# EAGLE schematic RADAR (EAGLE 7.4.0), part 1 of 2

## Sheet 1 of 3: Power Management
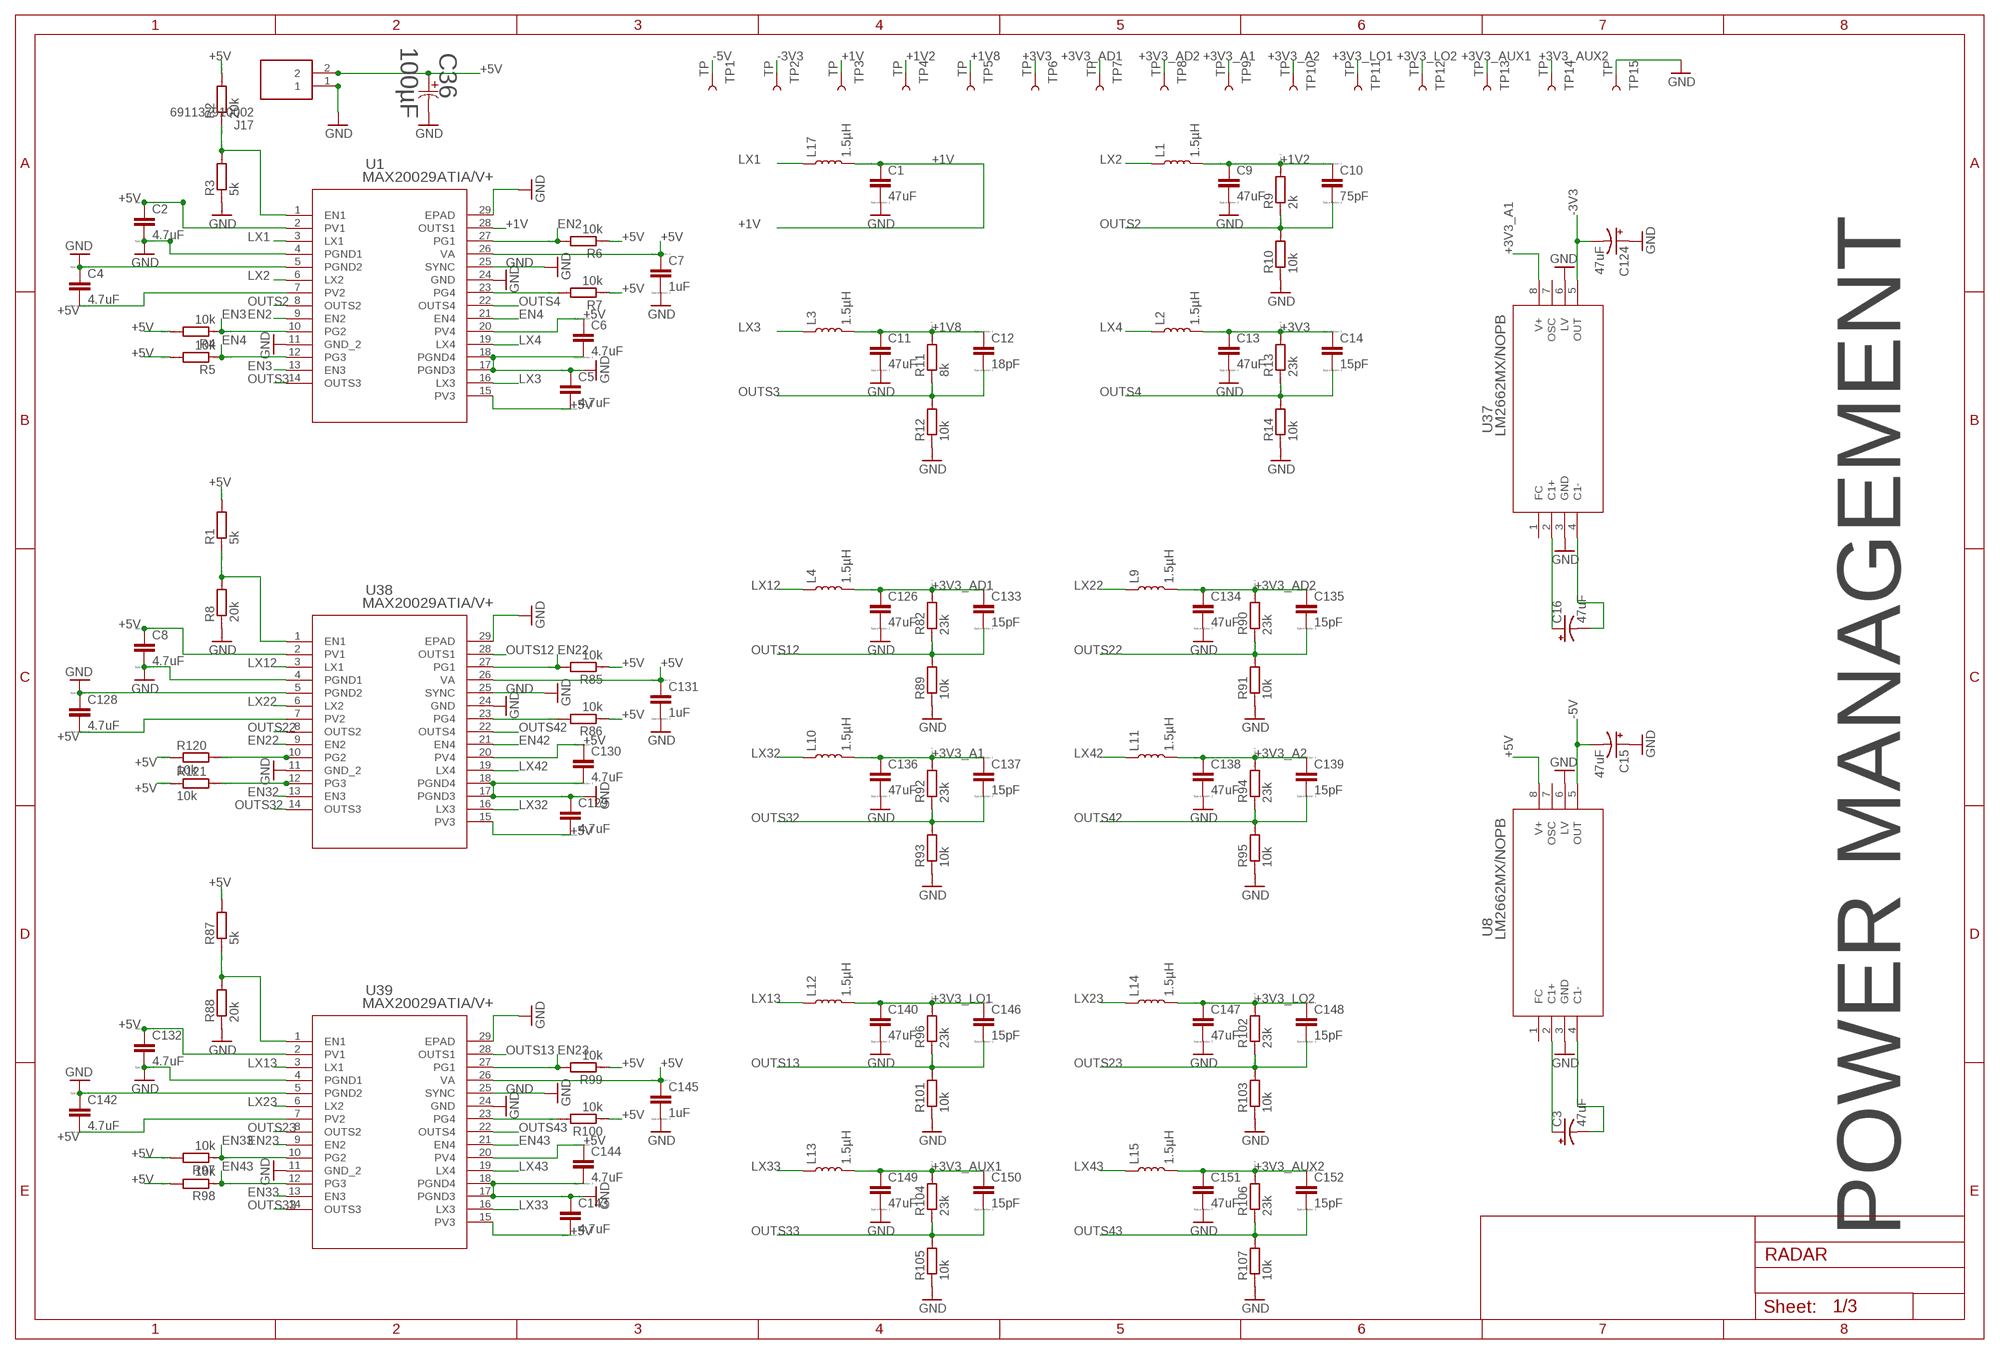
[diagram p0: schematic, sheet 1]

### Parts
C1  47uF  CC0201  [C0201]
C2  4.7uF  CC0201  [C0201]
C3  47uF  10UF-POLAR-0603-6.3V-20%(TANT)  [0603-POLAR]
C4  4.7uF  CC0201  [C0201]
C5  4.7uF  CC0201  [C0201]
C6  4.7uF  CC0201  [C0201]
C7  1uF  CC0201  [C0201]
C8  4.7uF  CC0201  [C0201]
C9  47uF  CC0201  [C0201]
C10  75pF  CC0201  [C0201]
C11  47uF  CC0201  [C0201]
C12  18pF  CC0201  [C0201]
C13  47uF  CC0201  [C0201]
C14  15pF  CC0201  [C0201]
C15  47uF  10UF-POLAR-0603-6.3V-20%(TANT)  [0603-POLAR]
C16  47uF  10UF-POLAR-0603-6.3V-20%(TANT)  [0603-POLAR]
C36  100µF  UCD1H101MNL1GS  [PCAP_8X10-ELECT_NCA]
C124  47uF  10UF-POLAR-0603-6.3V-20%(TANT)  [0603-POLAR]
C126  47uF  CC0201  [C0201]
C128  4.7uF  CC0201  [C0201]
C129  4.7uF  CC0201  [C0201]
C130  4.7uF  CC0201  [C0201]
C131  1uF  CC0201  [C0201]
C132  4.7uF  CC0201  [C0201]
C133  15pF  CC0201  [C0201]
C134  47uF  CC0201  [C0201]
C135  15pF  CC0201  [C0201]
C136  47uF  CC0201  [C0201]
C137  15pF  CC0201  [C0201]
C138  47uF  CC0201  [C0201]
C139  15pF  CC0201  [C0201]
C140  47uF  CC0201  [C0201]
C142  4.7uF  CC0201  [C0201]
C143  4.7uF  CC0201  [C0201]
C144  4.7uF  CC0201  [C0201]
C145  1uF  CC0201  [C0201]
C146  15pF  CC0201  [C0201]
C147  47uF  CC0201  [C0201]
C148  15pF  CC0201  [C0201]
C149  47uF  CC0201  [C0201]
C150  15pF  CC0201  [C0201]
C151  47uF  CC0201  [C0201]
C152  15pF  CC0201  [C0201]
J17  691137910002  [691137910002]
L1  1.5µH  2.2μH_SHIELDED_INDUCTOR  [0806]
L2  1.5µH  2.2μH_SHIELDED_INDUCTOR  [0806]
L3  1.5µH  2.2μH_SHIELDED_INDUCTOR  [0806]
L4  1.5µH  2.2μH_SHIELDED_INDUCTOR  [0806]
L9  1.5µH  2.2μH_SHIELDED_INDUCTOR  [0806]
L10  1.5µH  2.2μH_SHIELDED_INDUCTOR  [0806]
L11  1.5µH  2.2μH_SHIELDED_INDUCTOR  [0806]
L12  1.5µH  2.2μH_SHIELDED_INDUCTOR  [0806]
L13  1.5µH  2.2μH_SHIELDED_INDUCTOR  [0806]
L14  1.5µH  2.2μH_SHIELDED_INDUCTOR  [0806]
L15  1.5µH  2.2μH_SHIELDED_INDUCTOR  [0806]
L17  1.5µH  2.2μH_SHIELDED_INDUCTOR  [0806]
R1  5k  RR0201  [R0201]
R2  20k  RR0201  [R0201]
R3  5k  RR0201  [R0201]
R4  10k  RR0201  [R0201]
R5  10k  RR0201  [R0201]
R6  10k  RR0201  [R0201]
R7  10k  RR0201  [R0201]
R8  20k  RR0201  [R0201]
R9  2k  RR0201  [R0201]
R10  10k  RR0201  [R0201]
R11  8k  RR0201  [R0201]
R12  10k  RR0201  [R0201]
R13  23k  RR0201  [R0201]
R14  10k  RR0201  [R0201]
R82  23k  RR0201  [R0201]
R85  10k  RR0201  [R0201]
R86  10k  RR0201  [R0201]
R87  5k  RR0201  [R0201]
R88  20k  RR0201  [R0201]
R89  10k  RR0201  [R0201]
R90  23k  RR0201  [R0201]
R91  10k  RR0201  [R0201]
R92  23k  RR0201  [R0201]
R93  10k  RR0201  [R0201]
R94  23k  RR0201  [R0201]
R95  10k  RR0201  [R0201]
R96  23k  RR0201  [R0201]
R97  10k  RR0201  [R0201]
R98  10k  RR0201  [R0201]
R99  10k  RR0201  [R0201]
R100  10k  RR0201  [R0201]
R101  10k  RR0201  [R0201]
R102  23k  RR0201  [R0201]
R103  10k  RR0201  [R0201]
R104  23k  RR0201  [R0201]
R105  10k  RR0201  [R0201]
R106  23k  RR0201  [R0201]
R107  10k  RR0201  [R0201]
R120  10k  RR0201  [R0201]
R121  10k  RR0201  [R0201]
TP1  TP  TEST-POINT2  [PAD.02X.02]
TP2  TP  TEST-POINT2  [PAD.02X.02]
TP3  TP  TEST-POINT2  [PAD.02X.02]
TP4  TP  TEST-POINT2  [PAD.02X.02]
TP5  TP  TEST-POINT2  [PAD.02X.02]
TP6  TP  TEST-POINT2  [PAD.02X.02]
TP7  TP  TEST-POINT2  [PAD.02X.02]
TP8  TP  TEST-POINT2  [PAD.02X.02]
TP9  TP  TEST-POINT2  [PAD.02X.02]
TP10  TP  TEST-POINT2  [PAD.02X.02]
TP11  TP  TEST-POINT2  [PAD.02X.02]
TP12  TP  TEST-POINT2  [PAD.02X.02]
TP13  TP  TEST-POINT2  [PAD.02X.02]
TP14  TP  TEST-POINT2  [PAD.02X.02]
TP15  TP  TEST-POINT2  [PAD.02X.02]
U1  MAX20029ATIA/V+  [21-0140L_T2855-5_MXM]
U8  LM2662MX/NOPB  [M08A]
U37  LM2662MX/NOPB  [M08A]
U38  MAX20029ATIA/V+  [21-0140L_T2855-5_MXM]
U39  MAX20029ATIA/V+  [21-0140L_T2855-5_MXM]

### Nets
+1V: C1.1 L17.2 TP3.1 U1.28(OUTS1) ; also sheet 2
+1V2: C9.1 C10.1 L1.2 R9.2 TP4.1
+1V8: C11.1 C12.1 L3.2 R11.2 TP5.1 ; also sheet 2
+3V3: C13.1 C14.1 L2.2 R13.2 TP6.1 ; also sheet 2
+3V3_A1: C136.1 C137.1 L10.2 R92.2 TP9.1 U37.8(V+) ; also sheet 3
+3V3_A2: C138.1 C139.1 L11.2 R94.2 TP10.1 ; also sheet 3
+3V3_AD1: C126.1 C133.1 L4.2 R82.2 TP7.1 ; also sheet 3
+3V3_AD2: C134.1 C135.1 L9.2 R90.2 TP8.1 ; also sheet 3
+3V3_AUX1: C149.1 C150.1 L13.2 R104.2 TP13.1
+3V3_AUX2: C151.1 C152.1 L15.2 R106.2 TP14.1
+3V3_LO1: C140.1 C146.1 L12.2 R96.2 TP11.1 ; also sheet 3
+3V3_LO2: C147.1 C148.1 L14.2 R102.2 TP12.1 ; also sheet 3
+5V: C2.1 C4.2 C5.2 C6.1 C7.1 C8.1 C36.1 C128.2 C129.2 C130.1 C131.1 C132.1 C142.2 C143.2 C144.1 C145.1 J17.2 R1.2 R2.2 R4.2 R5.2 R6.1 R7.1 R85.1 R86.1 R87.2 R97.2 R98.2 R99.1 R100.1 R120.1 R121.1 U1.2(PV1) U1.7(PV2) U1.15(PV3) U1.20(PV4) U1.26(VA) U8.8(V+) U38.2(PV1) U38.7(PV2) U38.15(PV3) U38.20(PV4) U38.26(VA) U39.2(PV1) U39.7(PV2) U39.15(PV3) U39.20(PV4) U39.26(VA) ; also sheet 2,3
-3V3: C124.- TP2.1 U37.5(OUT) ; also sheet 3
-5V: C15.- TP1.1 U8.5(OUT) ; also sheet 3
EN2: R6.2 U1.9(EN2) U1.27(PG1)
EN3: R4.1 U1.10(PG2) U1.13(EN3)
EN4: R5.1 U1.12(PG3) U1.21(EN4)
EN22: R85.2 U38.9(EN2) U38.27(PG1)
EN23: R99.2 U39.9(EN2) U39.27(PG1)
EN32: U38.13(EN3) ; also sheet 2
EN33: R97.1 U39.10(PG2) U39.13(EN3)
EN42: U38.21(EN4) ; also sheet 2
EN43: R98.1 U39.12(PG3) U39.21(EN4)
GND: C1.2 C2.2 C4.1 C5.1 C6.2 C7.2 C8.2 C9.2 C11.2 C13.2 C15.+ C36.2 C124.+ C126.2 C128.1 C129.1 C130.2 C131.2 C132.2 C134.2 C136.2 C138.2 C140.2 C142.1 C143.1 C144.2 C145.2 C147.2 C149.2 C151.2 J17.1 R3.1 R8.1 R10.1 R12.1 R14.1 R88.1 R89.1 R91.1 R93.1 R95.1 R101.1 R103.1 R105.1 R107.1 TP15.1 U1.4(PGND1) U1.5(PGND2) U1.11(GND_2) U1.17(PGND3) U1.18(PGND4) U1.24(GND) U1.25(SYNC) U1.29(EPAD) U8.3(GND) U8.6(LV) U37.3(GND) U37.6(LV) U38.4(PGND1) U38.5(PGND2) U38.11(GND_2) U38.17(PGND3) U38.18(PGND4) U38.24(GND) U38.25(SYNC) U38.29(EPAD) U39.4(PGND1) U39.5(PGND2) U39.11(GND_2) U39.17(PGND3) U39.18(PGND4) U39.24(GND) U39.25(SYNC) U39.29(EPAD) ; also sheet 2,3
LX1: L17.1 U1.3(LX1)
LX2: L1.1 U1.6(LX2)
LX3: L3.1 U1.16(LX3)
LX4: L2.1 U1.19(LX4)
LX12: L4.1 U38.3(LX1)
LX13: L12.1 U39.3(LX1)
LX22: L9.1 U38.6(LX2)
LX23: L14.1 U39.6(LX2)
LX32: L10.1 U38.16(LX3)
LX33: L13.1 U39.16(LX3)
LX42: L11.1 U38.19(LX4)
LX43: L15.1 U39.19(LX4)
N$1: R2.1 R3.2 U1.1(EN1)
N$2: C3.+ U8.2(C1+)
N$3: C3.- U8.4(C1-)
N$15: R7.2 U1.23(PG4)
N$82: C16.+ U37.2(C1+)
N$85: C16.- U37.4(C1-)
N$86: R1.1 R8.2 U38.1(EN1)
N$87: R86.2 U38.23(PG4)
N$88: R87.1 R88.2 U39.1(EN1)
N$89: R100.2 U39.23(PG4)
OUTS2: C10.2 R9.1 R10.2 U1.8(OUTS2)
OUTS3: C12.2 R11.1 R12.2 U1.14(OUTS3)
OUTS4: C14.2 R13.1 R14.2 U1.22(OUTS4)
OUTS12: C133.2 R82.1 R89.2 U38.28(OUTS1)
OUTS13: C146.2 R96.1 R101.2 U39.28(OUTS1)
OUTS22: C135.2 R90.1 R91.2 U38.8(OUTS2)
OUTS23: C148.2 R102.1 R103.2 U39.8(OUTS2)
OUTS32: C137.2 R92.1 R93.2 U38.14(OUTS3)
OUTS33: C150.2 R104.1 R105.2 U39.14(OUTS3)
OUTS42: C139.2 R94.1 R95.2 U38.22(OUTS4)
OUTS43: C152.2 R106.1 R107.2 U39.22(OUTS4)
PG22: R120.2 U38.10(PG2)
PG32: R121.2 U38.12(PG3)
Unconnected: U8.1(FC) U8.7(OSC) U37.1(FC) U37.7(OSC)

### Notes on the sheet
- POWER MANAGEMENT

## Sheet 2 of 3: Digital (FPGA+microcontroller)
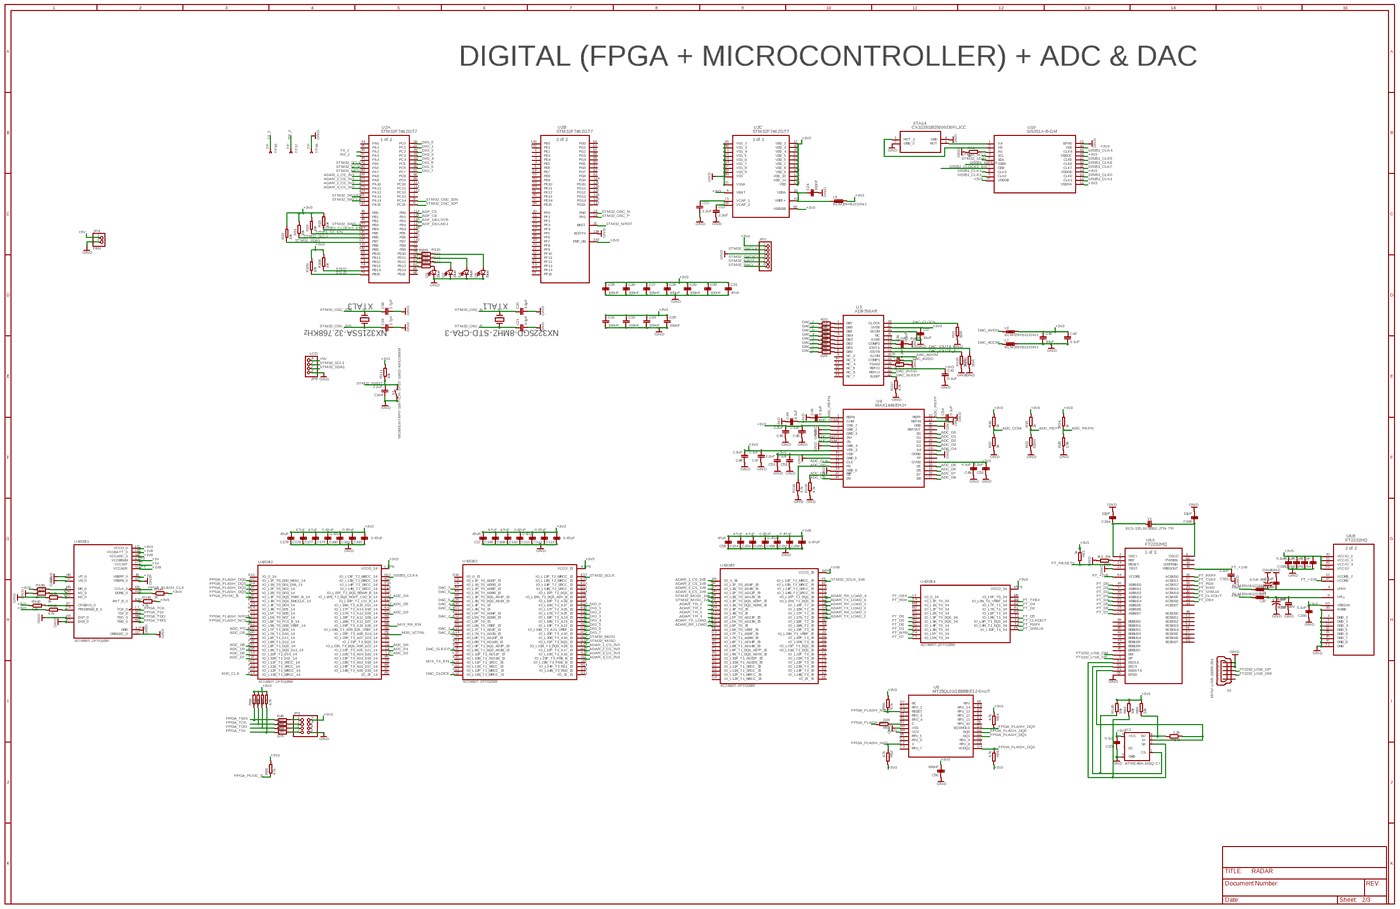
[diagram p1: schematic, sheet 2, overview]
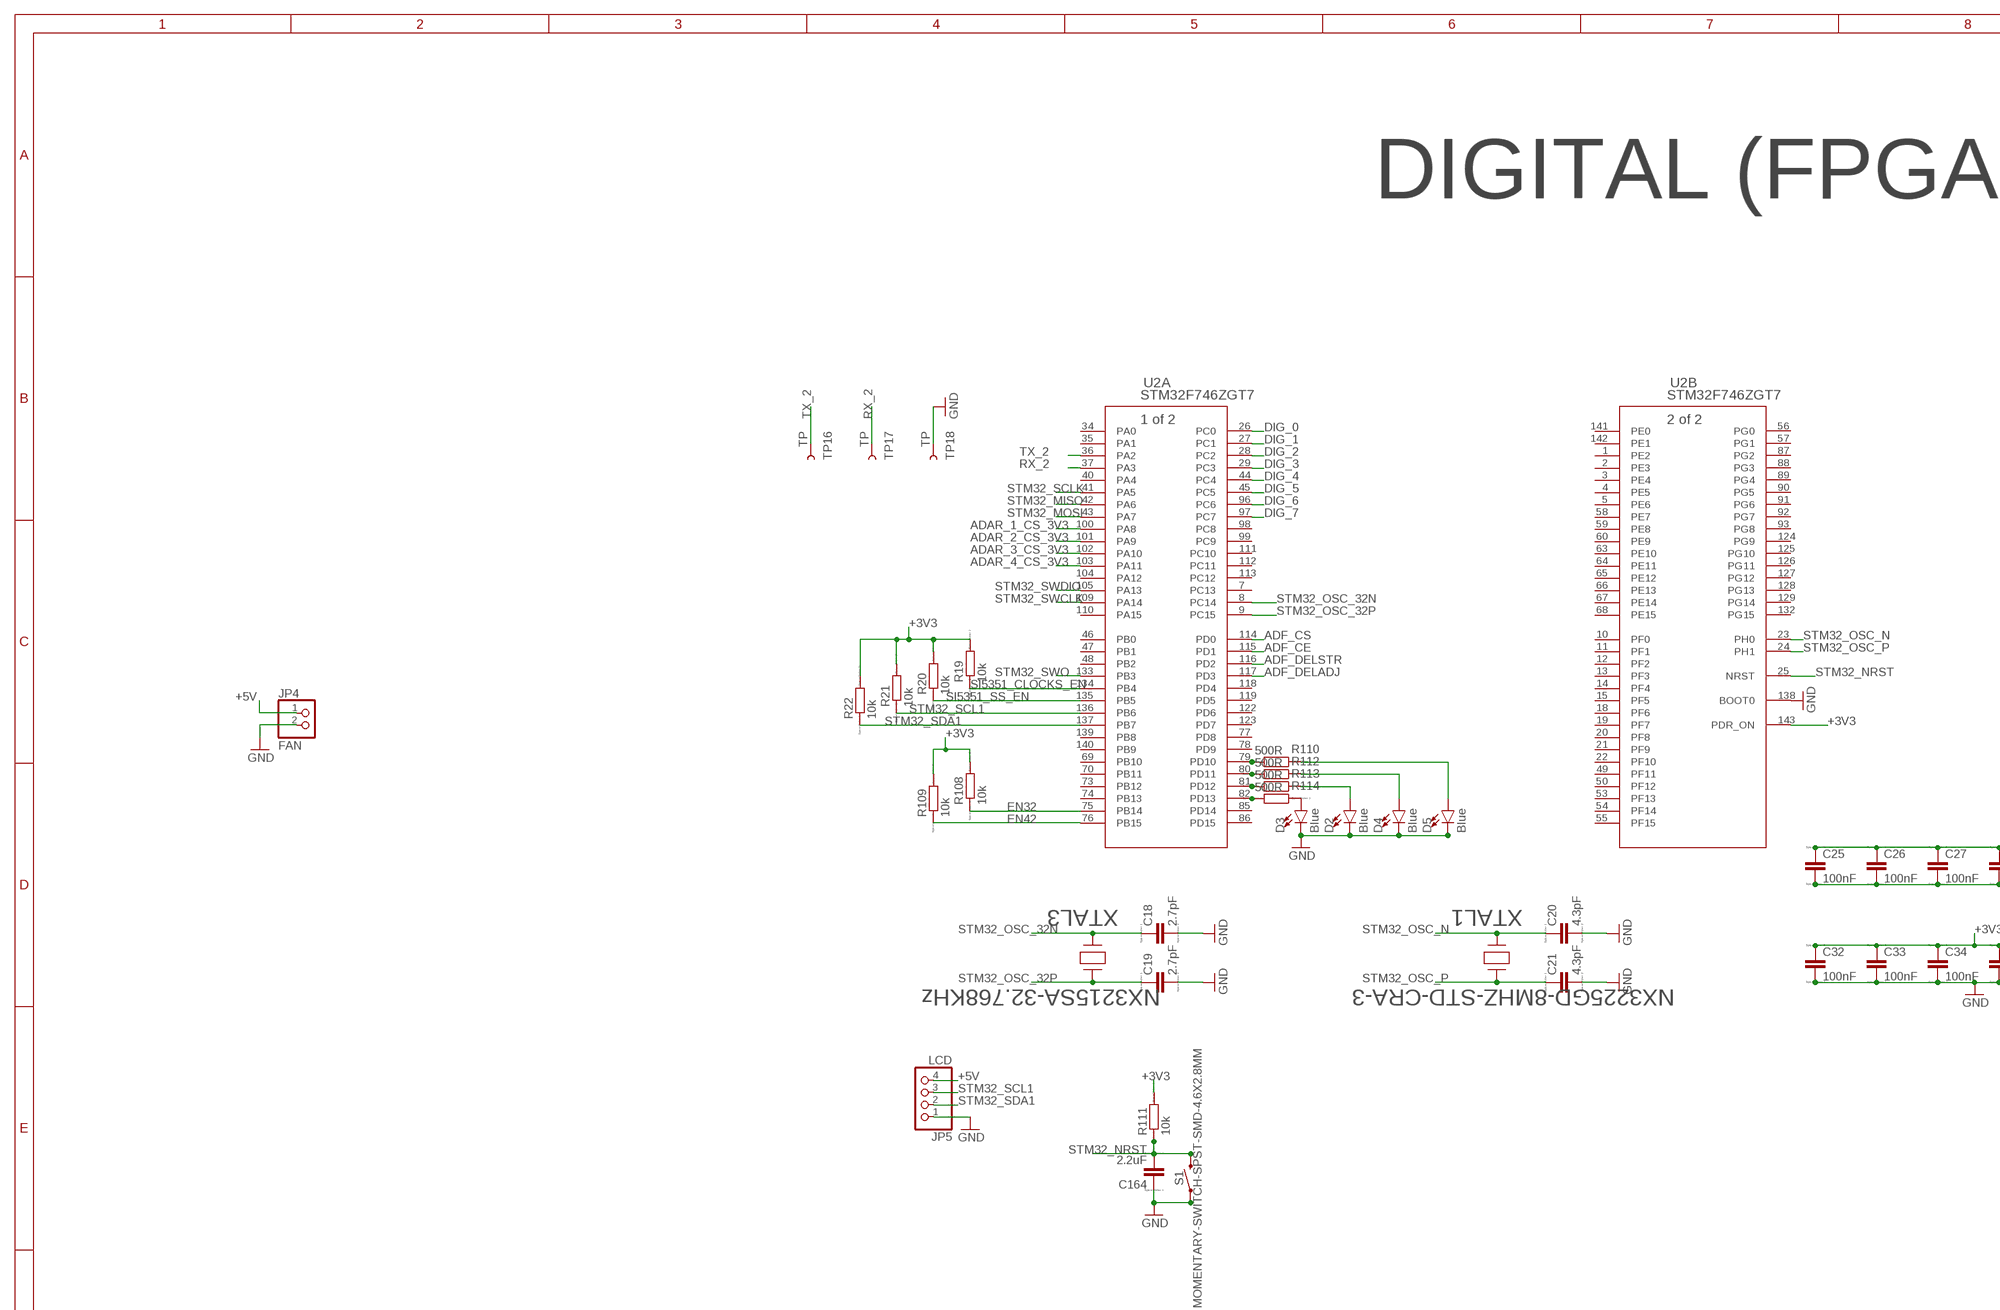
[diagram p2: schematic, sheet 2, part 1 of 4]
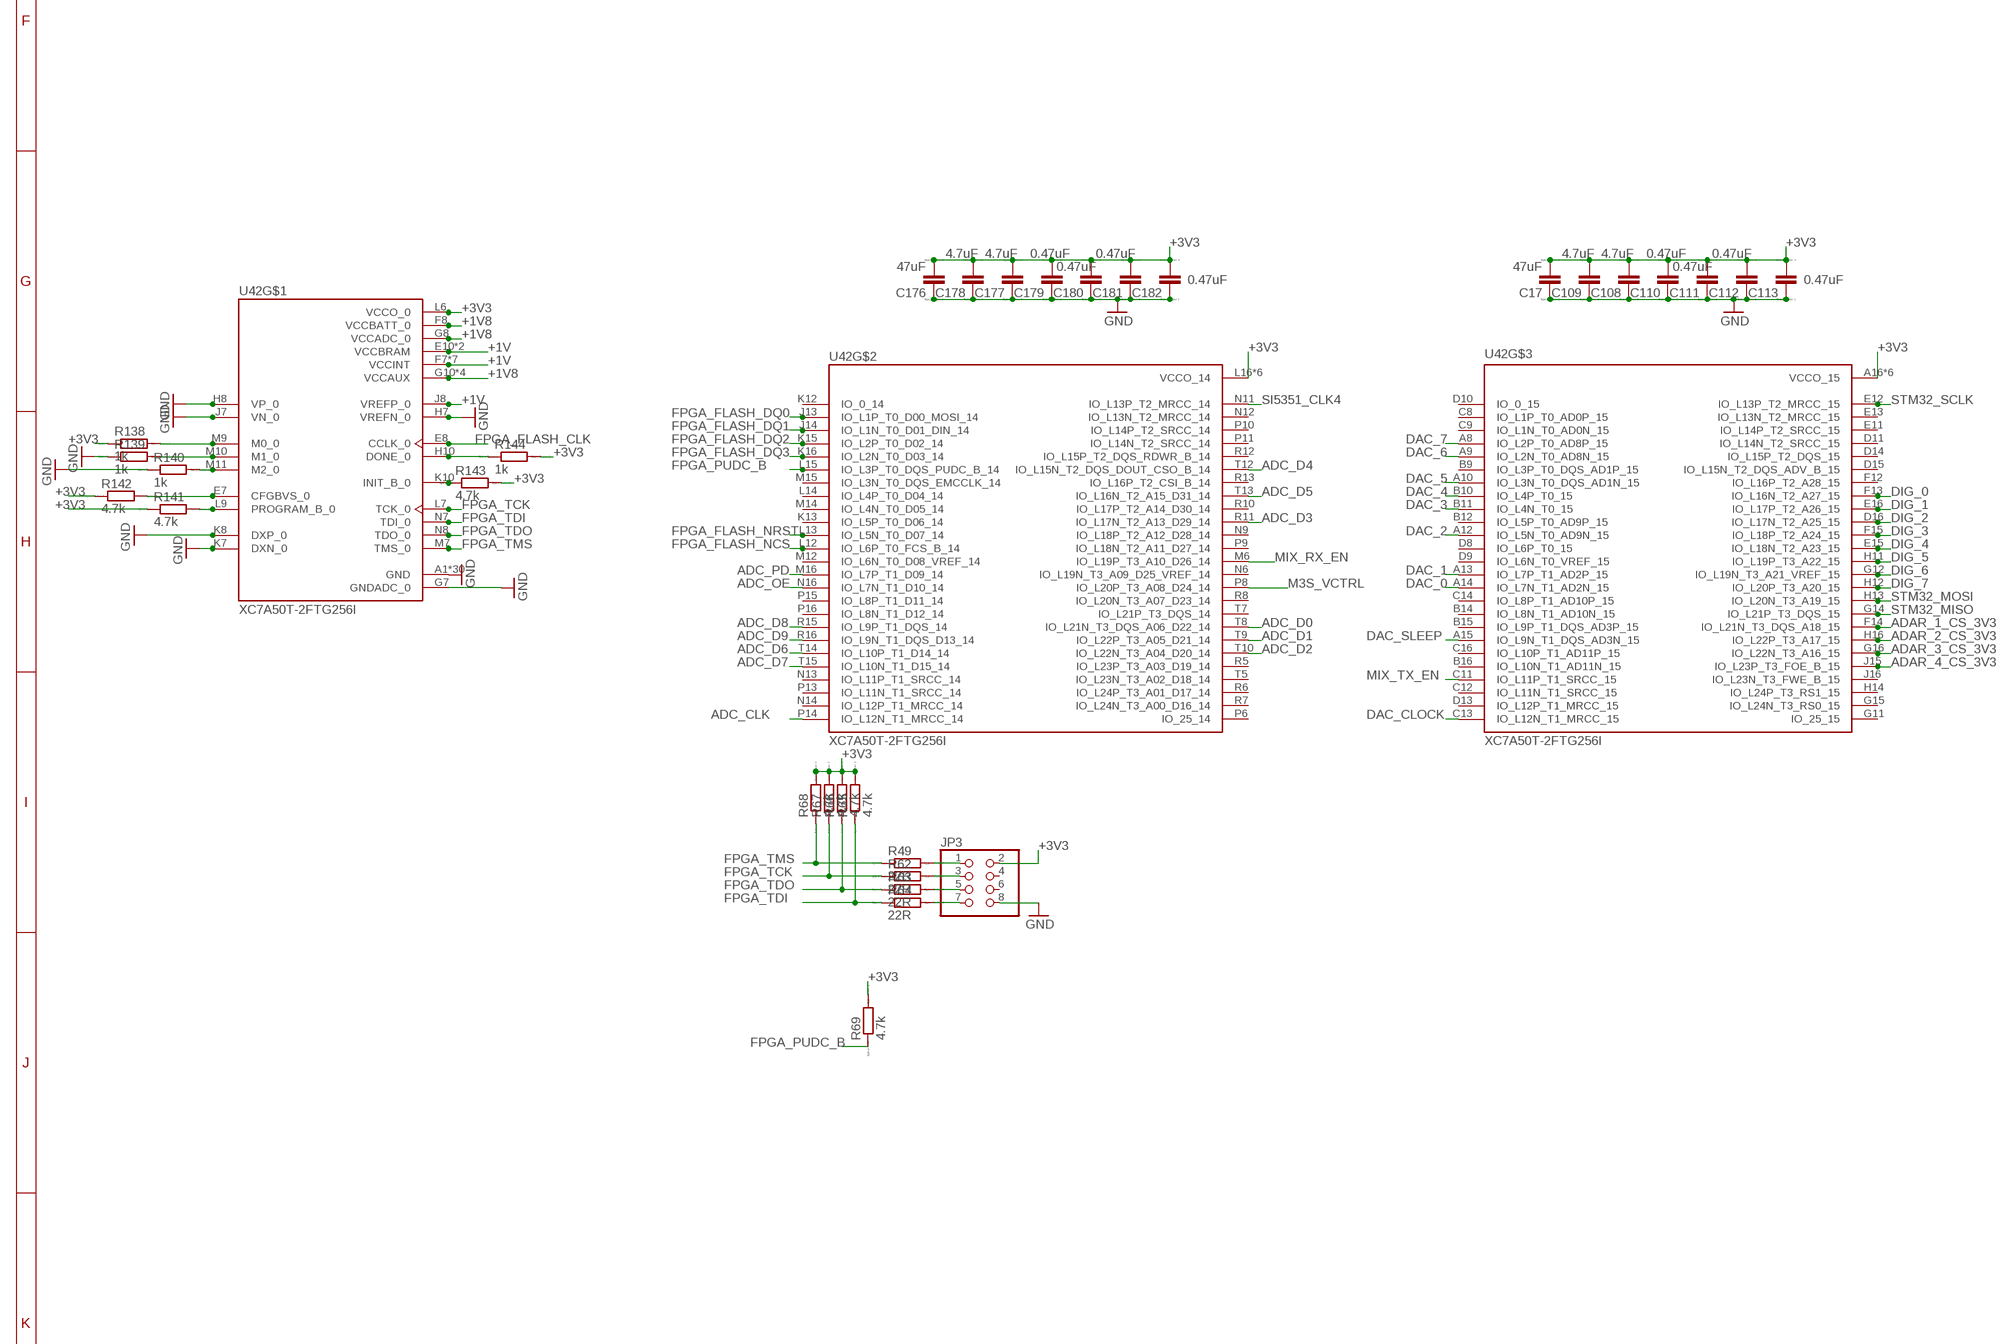
[diagram p3: schematic, sheet 2, part 2 of 4]
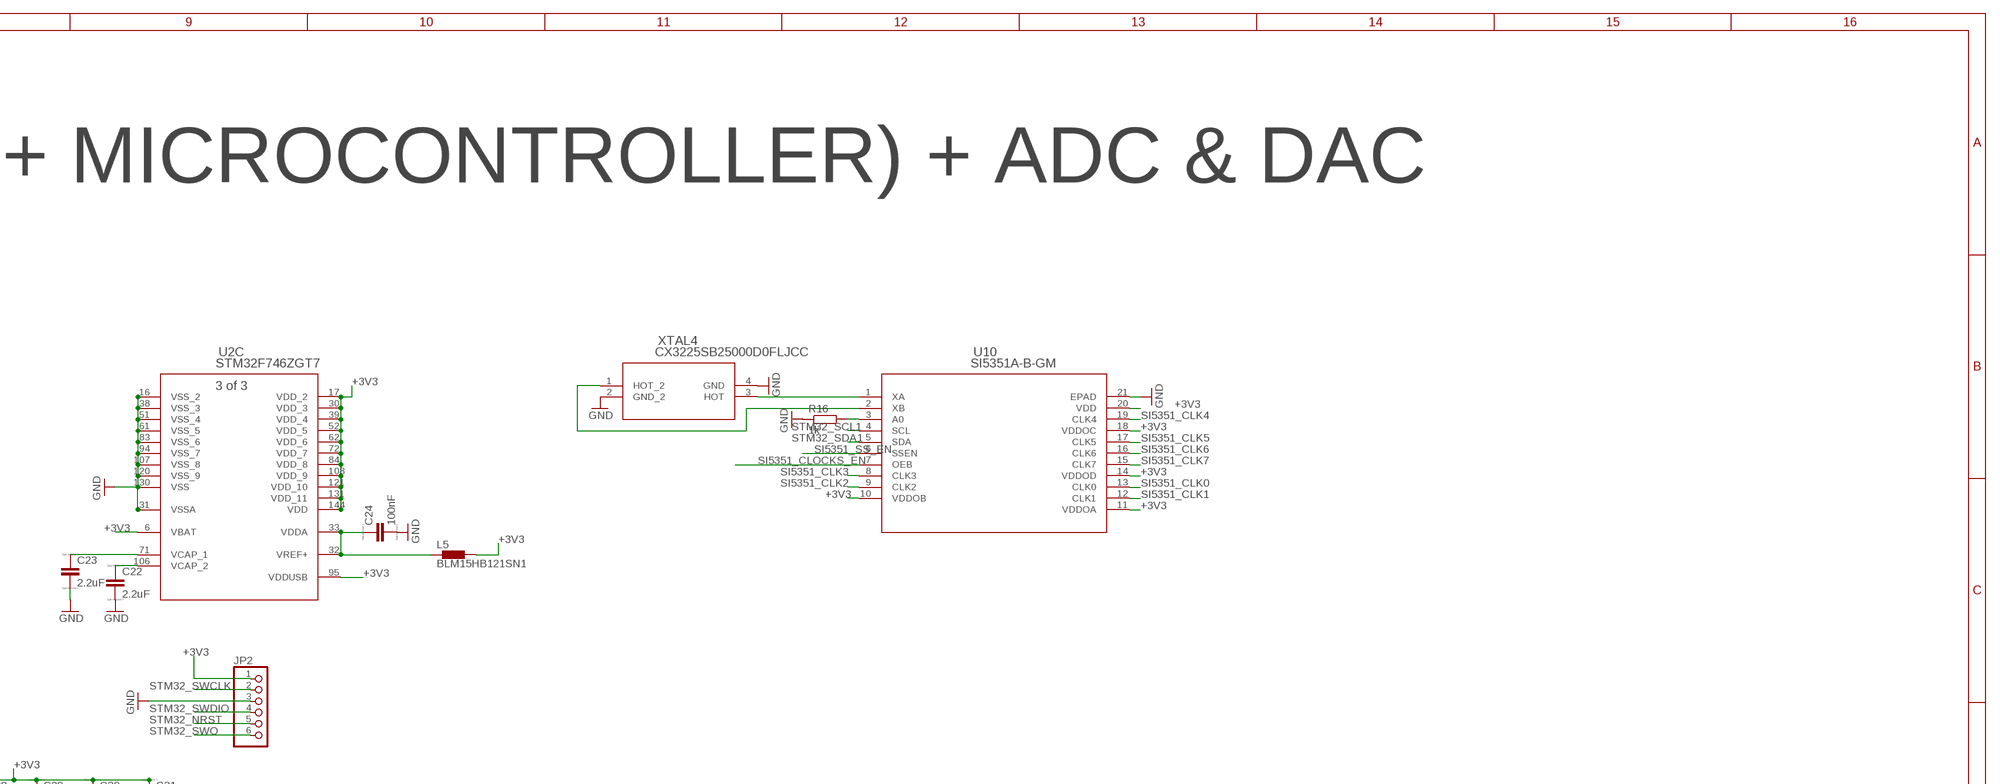
[diagram p4: schematic, sheet 2, part 3 of 4]
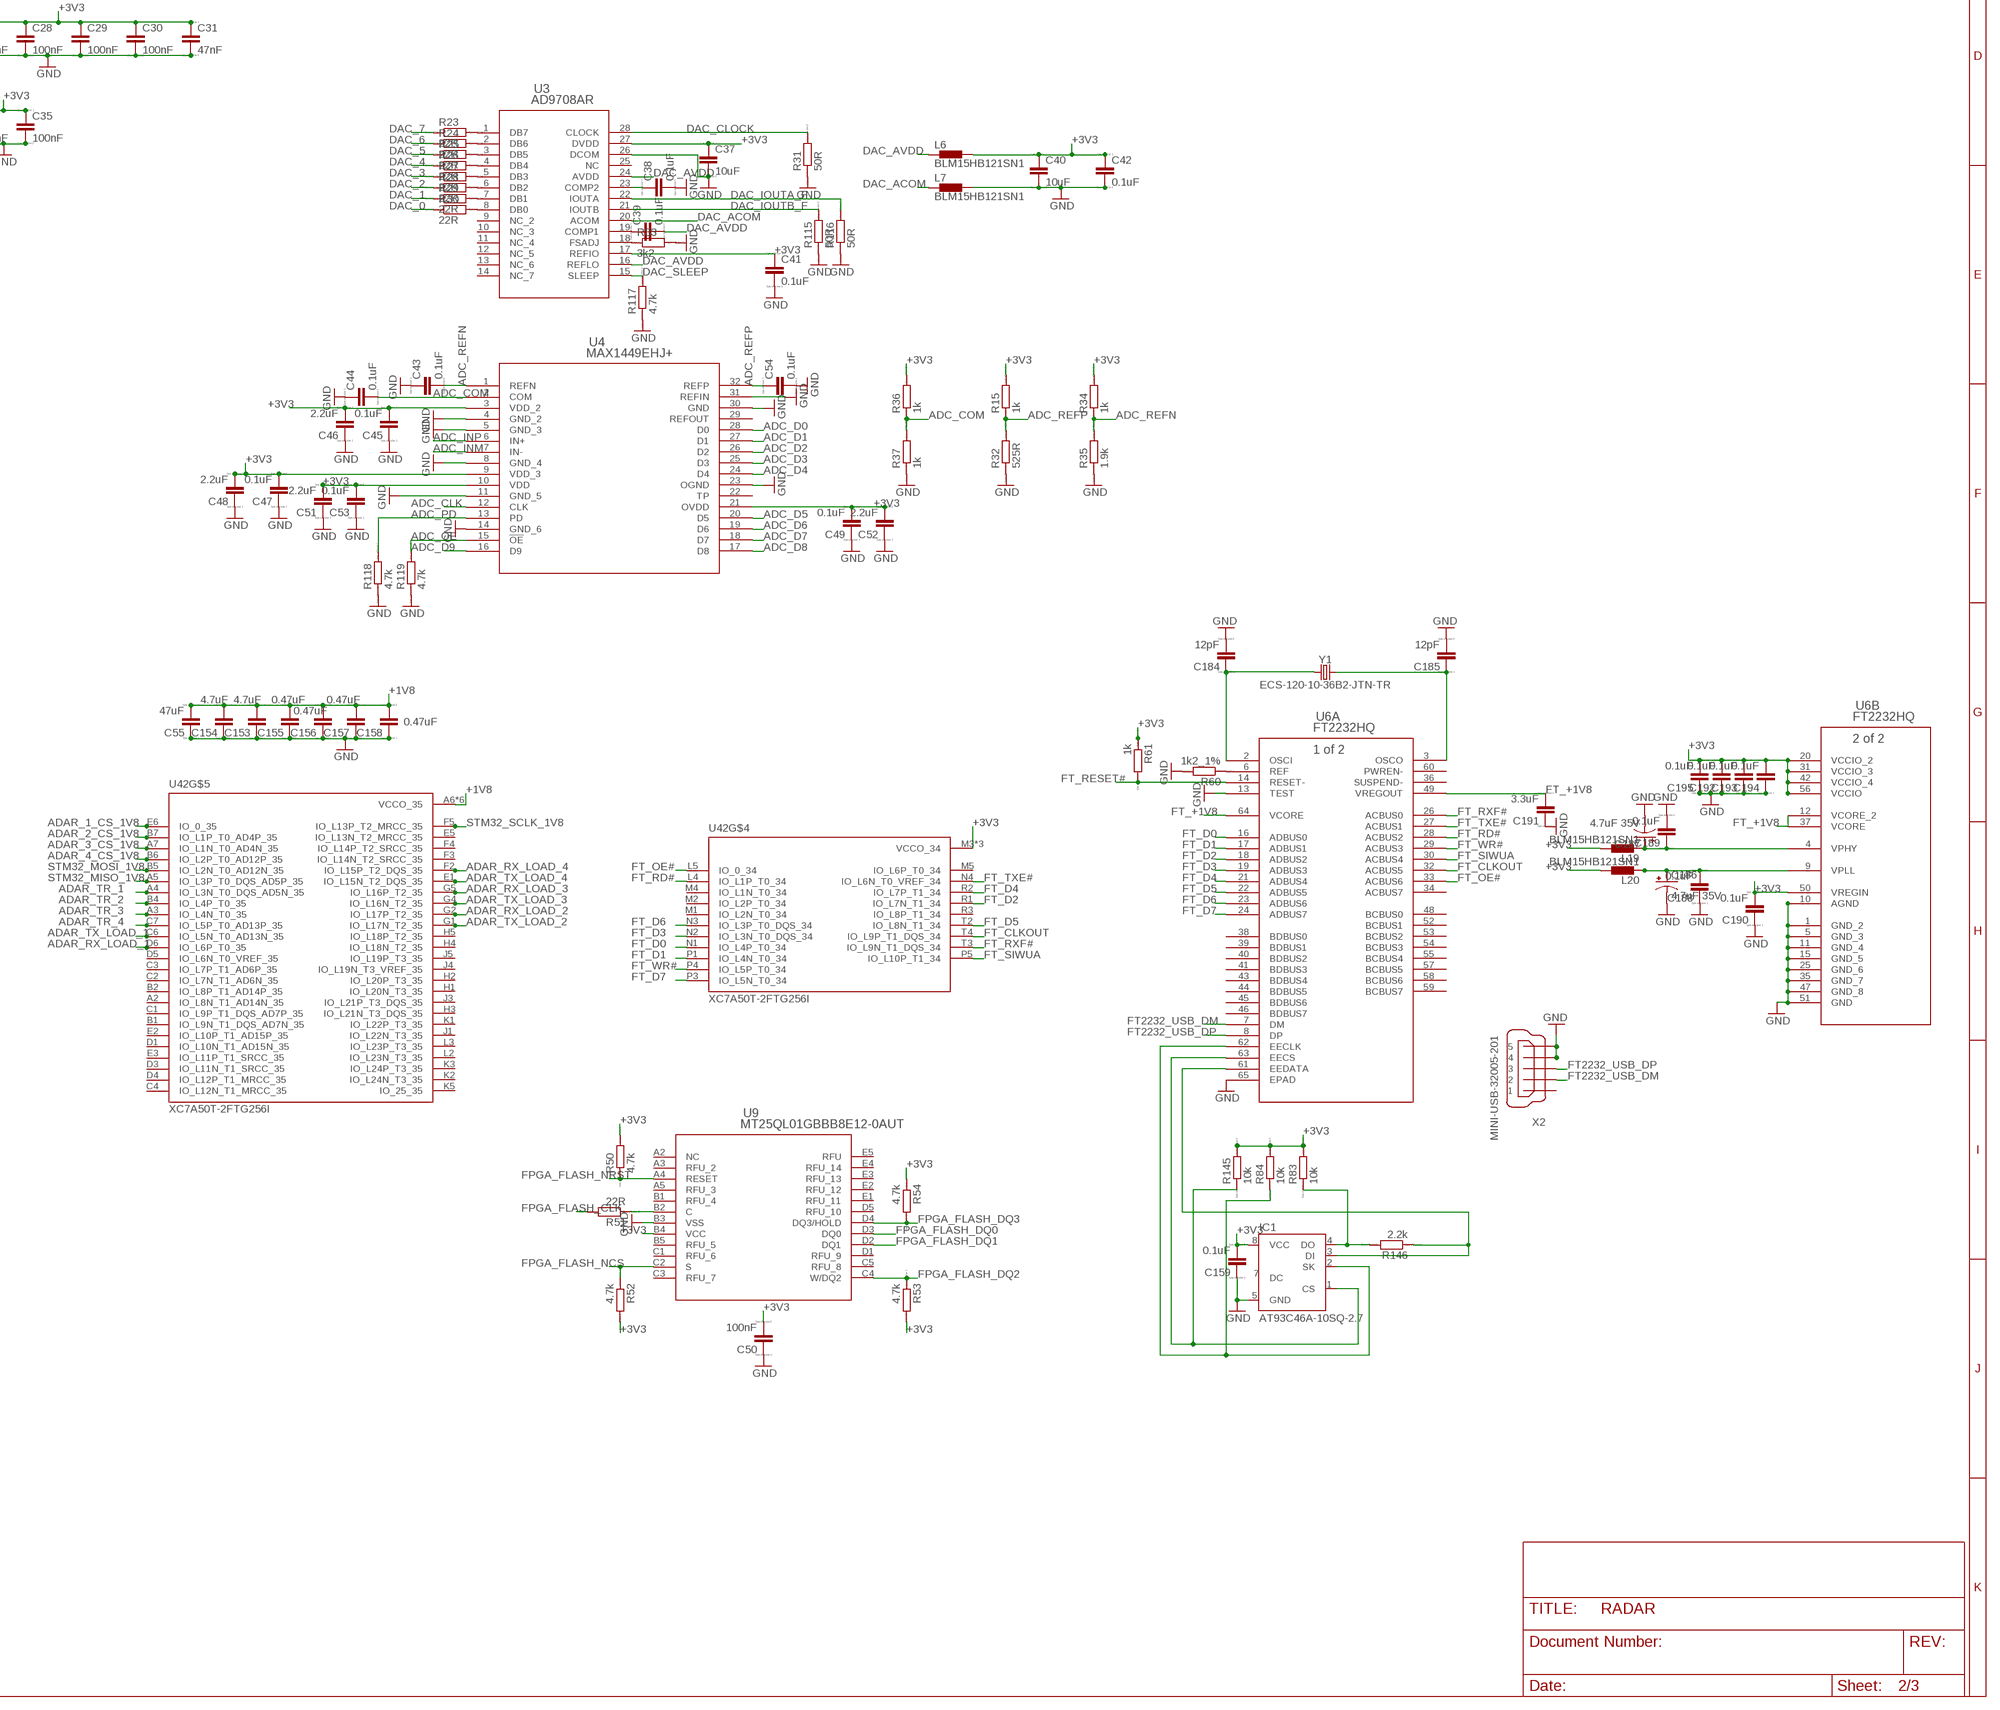
[diagram p5: schematic, sheet 2, part 4 of 4]

### Parts
C17  47uF  CC0201  [C0201]
C18  2.7pF  CC0201  [C0201]
C19  2.7pF  CC0201  [C0201]
C20  4.3pF  CC0201  [C0201]
C21  4.3pF  CC0201  [C0201]
C22  2.2uF  CC0201  [C0201]
C23  2.2uF  CC0201  [C0201]
C24  100nF  CC0201  [C0201]
C25  100nF  CC0201  [C0201]
C26  100nF  CC0201  [C0201]
C27  100nF  CC0201  [C0201]
C28  100nF  CC0201  [C0201]
C29  100nF  CC0201  [C0201]
C30  100nF  CC0201  [C0201]
C31  47nF  CC0201  [C0201]
C32  100nF  CC0201  [C0201]
C33  100nF  CC0201  [C0201]
C34  100nF  CC0201  [C0201]
C35  100nF  CC0201  [C0201]
C37  10uF  CC0201  [C0201]
C38  0.1uF  CC0201  [C0201]
C39  0.1uF  CC0201  [C0201]
C40  10uF  CC0201  [C0201]
C41  0.1uF  CC0201  [C0201]
C42  0.1uF  CC0201  [C0201]
C43  0.1uF  CC0201  [C0201]
C44  0.1uF  CC0201  [C0201]
C45  0.1uF  CC0201  [C0201]
C46  2.2uF  CC0201  [C0201]
C47  0.1uF  CC0201  [C0201]
C48  2.2uF  CC0201  [C0201]
C49  0.1uF  CC0201  [C0201]
C50  100nF  CC0201  [C0201]
C51  2.2uF  CC0201  [C0201]
C52  2.2uF  CC0201  [C0201]
C53  0.1uF  CC0201  [C0201]
C54  0.1uF  CC0201  [C0201]
C55  47uF  CC0201  [C0201]
C108  4.7uF  CC0201  [C0201]
C109  4.7uF  CC0201  [C0201]
C110  0.47uF  CC0201  [C0201]
C111  0.47uF  CC0201  [C0201]
C112  0.47uF  CC0201  [C0201]
C113  0.47uF  CC0201  [C0201]
C153  4.7uF  CC0201  [C0201]
C154  4.7uF  CC0201  [C0201]
C155  0.47uF  CC0201  [C0201]
C156  0.47uF  CC0201  [C0201]
C157  0.47uF  CC0201  [C0201]
C158  0.47uF  CC0201  [C0201]
C159  0.1uF  CC0201  [C0201]
C164  2.2uF  CC0201  [C0201]
C176  47uF  CC0201  [C0201]
C177  4.7uF  CC0201  [C0201]
C178  4.7uF  CC0201  [C0201]
C179  0.47uF  CC0201  [C0201]
C180  0.47uF  CC0201  [C0201]
C181  0.47uF  CC0201  [C0201]
C182  0.47uF  CC0201  [C0201]
C184  12pF  CC0201  [C0201]
C185  12pF  CC0201  [C0201]
C186  4.7uF 35V  4.7UF-POLAR-EIA3528-35V-10%(TANT)  [EIA3528]
C187  4.7uF 35V  4.7UF-POLAR-EIA3528-35V-10%(TANT)  [EIA3528]
C188  0.1uF  CC0201  [C0201]
C189  0.1uF  CC0201  [C0201]
C190  0.1uF  CC0201  [C0201]
C191  3.3uF  CC0201  [C0201]
C192  0.1uF  CC0201  [C0201]
C193  0.1uF  CC0201  [C0201]
C194  0.1uF  CC0201  [C0201]
C195  0.1uF  CC0201  [C0201]
D2  Blue  LED-BLUE0603  [LED-0603]
D3  Blue  LED-BLUE0603  [LED-0603]
D4  Blue  LED-BLUE0603  [LED-0603]
D5  Blue  LED-BLUE0603  [LED-0603]
IC1  AT93C46A-10SQ-2.7  [SOIC8]
JP2  PINHD-1X6  [1X06]
JP3  PINHD-2X4  [2X04]
JP4  FAN  PINHD-1X2  [1X02]
JP5  LCD  PINHD-1X4  [1X04]
L5  BLM15HB121SN1  [0402]
L6  BLM15HB121SN1  [0402]
L7  BLM15HB121SN1  [0402]
L19  BLM15HB121SN1  [0402]
L20  BLM15HB121SN1  [0402]
R15  1k  RR0201  [R0201]
R16  1k  RR0201  [R0201]
R19  10k  RR0201  [R0201]
R20  10k  RR0201  [R0201]
R21  10k  RR0201  [R0201]
R22  10k  RR0201  [R0201]
R23  22R  RR0201  [R0201]
R24  22R  RR0201  [R0201]
R25  22R  RR0201  [R0201]
R26  22R  RR0201  [R0201]
R27  22R  RR0201  [R0201]
R28  22R  RR0201  [R0201]
R29  22R  RR0201  [R0201]
R30  22R  RR0201  [R0201]
R31  50R  RR0201  [R0201]
R32  525R  RR0201  [R0201]
R33  3k2  RR0201  [R0201]
R34  1k  RR0201  [R0201]
R35  1.9k  RR0201  [R0201]
R36  1k  RR0201  [R0201]
R37  1k  RR0201  [R0201]
R49  22R  RR0201  [R0201]
R50  4.7k  RR0201  [R0201]
R51  22R  RR0201  [R0201]
R52  4.7k  RR0201  [R0201]
R53  4.7k  RR0201  [R0201]
R54  4.7k  RR0201  [R0201]
R60  1k2_1%  RR0201  [R0201]
R61  1k  RR0201  [R0201]
R62  22R  RR0201  [R0201]
R63  22R  RR0201  [R0201]
R64  22R  RR0201  [R0201]
R65  4.7k  RR0201  [R0201]
R66  4.7k  RR0201  [R0201]
R67  4.7k  RR0201  [R0201]
R68  4.7k  RR0201  [R0201]
R69  4.7k  RR0201  [R0201]
R83  10k  RR0201  [R0201]
R84  10k  RR0201  [R0201]
R108  10k  RR0201  [R0201]
R109  10k  RR0201  [R0201]
R110  500R  RR0201  [R0201]
R111  10k  RR0201  [R0201]
R112  500R  RR0201  [R0201]
R113  500R  RR0201  [R0201]
R114  500R  RR0201  [R0201]
R115  50R  RR0201  [R0201]
R116  50R  RR0201  [R0201]
R117  4.7k  RR0201  [R0201]
R118  4.7k  RR0201  [R0201]
R119  4.7k  RR0201  [R0201]
R138  1k  RR0201  [R0201]
R139  1k  RR0201  [R0201]
R140  1k  RR0201  [R0201]
R141  4.7k  RR0201  [R0201]
R142  4.7k  RR0201  [R0201]
R143  4.7k  RR0201  [R0201]
R144  1k  RR0201  [R0201]
R145  10k  RR0201  [R0201]
R146  2.2k  RR0201  [R0201]
S1  MOMENTARY-SWITCH-SPST-SMD-4.6X2.8MM  [TACTILE_SWITCH_SMD_4.6X2.8MM]
TP16  TP  TEST-POINT2  [PAD.02X.02]
TP17  TP  TEST-POINT2  [PAD.02X.02]
TP18  TP  TEST-POINT2  [PAD.02X.02]
U2  STM32F746ZGT7  [LQFP-144_STM]
U3  AD9708AR  [RW_28_ADI]
U4  MAX1449EHJ+  [21-0110B_MXM]
U6  FT2232HQ  [64QFN_FT2232HQ_FTD]
U9  MT25QL01GBBB8E12-0AUT  [BGA24_MT25QL_MRN]
U10  SI5351A-B-GM  [QFN20_SIL]
U42  XC7A50T-2FTG256I  [BGA256C100P16X16_1700X1700X155]
X2  MINI-USB-32005-201  [32005-201]
XTAL1  NX3225GD-8MHZ-STD-CRA-3  [XTAL_NX3225GD-8MHZ-STD-CRA-3_N]
XTAL3  NX3215SA-32.768KHz  NX3225GD-8MHZ-STD-CRA-3  [XTAL_NX3225GD-8MHZ-STD-CRA-3_N]
XTAL4  CX3225SB25000D0FLJCC  CX3225SB25000D0FLJZ1  [XTAL4_CX3225SB_AVX]
Y1  ECS-120-10-36B2-JTN-TR  CRYSTAL-12MHZ  [CRYSTAL-SMD-2X2.5MM]

### Nets
+1V: U42.E10(VCCBRAM) U42.F7(VCCINT) U42.F9(VCCINT) U42.F11(VCCBRAM) U42.G6(VCCINT) U42.H9(VCCINT) U42.J6(VCCINT) U42.J8(VREFP_0) U42.K9(VCCINT) U42.L8(VCCINT) ; also sheet 1
+1V8: C55.2 C153.2 C154.2 C155.2 C156.2 C157.2 C158.2 U42.A6(VCCO_35) U42.B3(VCCO_35) U42.D7(VCCO_35) U42.E4(VCCO_35) U42.F1(VCCO_35) U42.F8(VCCBATT_0) U42.G8(VCCADC_0) U42.G10(VCCAUX) U42.J2(VCCO_35) U42.J10(VCCAUX) U42.K11(VCCAUX) U42.L10(VCCAUX) ; also sheet 1
+3V3: C17.2 C25.1 C26.1 C27.1 C28.1 C29.1 C30.1 C31.1 C32.1 C33.1 C34.1 C35.1 C37.1 C40.1 C41.1 C42.1 C45.2 C46.2 C47.2 C48.2 C49.2 C50.2 C51.2 C52.2 C53.2 C108.2 C109.2 C110.2 C111.2 C112.2 C113.2 C159.2 C176.2 C177.2 C178.2 C179.2 C180.2 C181.2 C182.2 C190.2 C192.2 C193.2 C194.2 C195.2 IC1.8(VCC) JP2.1 JP3.2 L5.2 L6.2 L19.2 L20.2 R15.2 R19.2 R20.2 R21.2 R22.2 R34.2 R36.2 R50.2 R52.2 R53.2 R54.1 R61.1 R65.2 R66.2 R67.2 R68.2 R69.2 R83.2 R84.2 R108.2 R109.2 R111.2 R138.1 R141.1 R142.1 R143.2 R144.2 R145.2 U2.6(C:VBAT) U2.17(C:VDD_2) U2.30(C:VDD_3) U2.39(C:VDD_4) U2.52(C:VDD_5) U2.62(C:VDD_6) U2.72(C:VDD_7) U2.84(C:VDD_8) U2.95(C:VDDUSB) U2.108(C:VDD_9) U2.121(C:VDD_10) U2.131(C:VDD_11) U2.143(B:PDR_ON) U2.144(C:VDD) U3.17(REFIO) U3.27(DVDD) U4.3(VDD_2) U4.9(VDD_3) U4.10(VDD) U4.21(OVDD) U6.20(B:VCCIO_2) U6.31(B:VCCIO_3) U6.42(B:VCCIO_4) U6.50(B:VREGIN) U6.56(B:VCCIO) U9.B4(VCC) U10.10(VDDOB) U10.11(VDDOA) U10.14(VDDOD) U10.18(VDDOC) U10.20(VDD) U42.A16(VCCO_15) U42.B13(VCCO_15) U42.C10(VCCO_15) U42.E14(VCCO_15) U42.H15(VCCO_15) U42.J12(VCCO_15) U42.L6(VCCO_0) U42.L16(VCCO_14) U42.M3(VCCO_34) U42.M13(VCCO_14) U42.N10(VCCO_14) U42.P7(VCCO_14) U42.R4(VCCO_34) U42.R14(VCCO_14) U42.T1(VCCO_34) U42.T11(VCCO_14) ; also sheet 1
+5V: JP4.1 JP5.4 ; also sheet 1,3
ADAR_1_CS_1V8: U42.E6(IO_0_35) ; also sheet 3
ADAR_1_CS_3V3: U2.100(A:PA8) U42.F14(IO_L21N_T3_DQS_A18_15)
ADAR_2_CS_1V8: U42.B7(IO_L1P_T0_AD4P_35) ; also sheet 3
ADAR_2_CS_3V3: U2.101(A:PA9) U42.H16(IO_L22P_T3_A17_15)
ADAR_3_CS_1V8: U42.A7(IO_L1N_T0_AD4N_35) ; also sheet 3
ADAR_3_CS_3V3: U2.102(A:PA10) U42.G16(IO_L22N_T3_A16_15)
ADAR_4_CS_1V8: U42.B6(IO_L2P_T0_AD12P_35) ; also sheet 3
ADAR_4_CS_3V3: U2.103(A:PA11) U42.J15(IO_L23P_T3_FOE_B_15)
ADAR_RX_LOAD_1: U42.D6(IO_L6P_T0_35) ; also sheet 3
ADAR_RX_LOAD_2: U42.G2(IO_L17P_T2_35) ; also sheet 3
ADAR_RX_LOAD_3: U42.G5(IO_L16P_T2_35) ; also sheet 3
ADAR_RX_LOAD_4: U42.F2(IO_L15P_T2_DQS_35) ; also sheet 3
ADAR_TR_1: U42.A4(IO_L3N_T0_DQS_AD5N_35) ; also sheet 3
ADAR_TR_2: U42.B4(IO_L4P_T0_35) ; also sheet 3
ADAR_TR_3: U42.A3(IO_L4N_T0_35) ; also sheet 3
ADAR_TR_4: U42.C7(IO_L5P_T0_AD13P_35) ; also sheet 3
ADAR_TX_LOAD_1: U42.C6(IO_L5N_T0_AD13N_35) ; also sheet 3
ADAR_TX_LOAD_2: U42.G1(IO_L17N_T2_35) ; also sheet 3
ADAR_TX_LOAD_3: U42.G4(IO_L16N_T2_35) ; also sheet 3
ADAR_TX_LOAD_4: U42.E1(IO_L15N_T2_DQS_35) ; also sheet 3
ADC_CLK: U4.12(CLK) U42.P14(IO_L12N_T1_MRCC_14)
ADC_COM: C44.2 R36.1 R37.2 U4.2(COM) ; also sheet 3
ADC_D0: U4.28(D0) U42.T8(IO_L21N_T3_DQS_A06_D22_14)
ADC_D1: U4.27(D1) U42.T9(IO_L22P_T3_A05_D21_14)
ADC_D2: U4.26(D2) U42.T10(IO_L22N_T3_A04_D20_14)
ADC_D3: U4.25(D3) U42.R11(IO_L17N_T2_A13_D29_14)
ADC_D4: U4.24(D4) U42.T12(IO_L15N_T2_DQS_DOUT_CSO_B_14)
ADC_D5: U4.20(D5) U42.T13(IO_L16N_T2_A15_D31_14)
ADC_D6: U4.19(D6) U42.T14(IO_L10P_T1_D14_14)
ADC_D7: U4.18(D7) U42.T15(IO_L10N_T1_D15_14)
ADC_D8: U4.17(D8) U42.R15(IO_L9P_T1_DQS_14)
ADC_D9: U4.16(D9) U42.R16(IO_L9N_T1_DQS_D13_14)
ADC_INM: U4.7(IN-) ; also sheet 3
ADC_INP: U4.6(IN+) ; also sheet 3
ADC_OE: R119.2 U4.15(!OE) U42.N16(IO_L7N_T1_D10_14)
ADC_PD: R118.2 U4.13(PD) U42.M16(IO_L7P_T1_D09_14)
ADC_REFN: C43.2 R34.1 R35.2 U4.1(REFN)
ADC_REFP: C54.1 R15.1 R32.2 U4.32(REFP)
ADF_CE: U2.115(A:PD1) ; also sheet 3
ADF_CS: U2.114(A:PD0) ; also sheet 3
ADF_DELADJ: U2.117(A:PD3) ; also sheet 3
ADF_DELSTR: U2.116(A:PD2) ; also sheet 3
DAC_0: R30.1 U42.A14(IO_L7N_T1_AD2N_15)
DAC_1: R29.1 U42.A13(IO_L7P_T1_AD2P_15)
DAC_2: R28.1 U42.A12(IO_L5N_T0_AD9N_15)
DAC_3: R27.1 U42.B11(IO_L4N_T0_15)
DAC_4: R26.1 U42.B10(IO_L4P_T0_15)
DAC_5: R25.1 U42.A10(IO_L3N_T0_DQS_AD1N_15)
DAC_6: R24.1 U42.A9(IO_L2N_T0_AD8N_15)
DAC_7: R23.1 U42.A8(IO_L2P_T0_AD8P_15)
DAC_ACOM: L7.1 U3.20(ACOM)
DAC_AVDD: C39.2 L6.1 U3.16(REFLO) U3.24(AVDD)
DAC_CLOCK: R31.2 U3.28(CLOCK) U42.C13(IO_L12N_T1_MRCC_15)
DAC_IOUTA_F: R116.2 U3.22(IOUTA) ; also sheet 3
DAC_IOUTB_F: R115.2 U3.21(IOUTB) ; also sheet 3
DAC_SLEEP: R117.2 U3.15(SLEEP) U42.A15(IO_L9N_T1_DQS_AD3N_15)
DIG_0: U2.26(A:PC0) U42.F13(IO_L16N_T2_A27_15)
DIG_1: U2.27(A:PC1) U42.E16(IO_L17P_T2_A26_15)
DIG_2: U2.28(A:PC2) U42.D16(IO_L17N_T2_A25_15)
DIG_3: U2.29(A:PC3) U42.F15(IO_L18P_T2_A24_15)
DIG_4: U2.44(A:PC4) U42.E15(IO_L18N_T2_A23_15)
DIG_5: U2.45(A:PC5) U42.H11(IO_L19P_T3_A22_15)
DIG_6: U2.96(A:PC6) U42.G12(IO_L19N_T3_A21_VREF_15)
DIG_7: U2.97(A:PC7) U42.H12(IO_L20P_T3_A20_15)
EN32: R108.1 U2.75(A:PB14) ; also sheet 1
EN42: R109.1 U2.76(A:PB15) ; also sheet 1
FPGA_FLASH_CLK: R51.2 U42.E8(CCLK_0)
FPGA_FLASH_DQ0: U9.D3(DQ0) U42.J13(IO_L1P_T0_D00_MOSI_14)
FPGA_FLASH_DQ1: U9.D2(DQ1) U42.J14(IO_L1N_T0_D01_DIN_14)
FPGA_FLASH_DQ2: R53.1 U9.C4(W/DQ2) U42.K15(IO_L2P_T0_D02_14)
FPGA_FLASH_DQ3: R54.2 U9.D4(DQ3/HOLD) U42.K16(IO_L2N_T0_D03_14)
FPGA_FLASH_NCS: R52.1 U9.C2(S) U42.L12(IO_L6P_T0_FCS_B_14)
FPGA_FLASH_NRST: R50.1 U9.A4(RESET) U42.L13(IO_L5N_T0_D07_14)
FPGA_PUDC_B: R69.1 U42.L15(IO_L3P_T0_DQS_PUDC_B_14)
FPGA_TCK: R62.1 R67.1 U42.L7(TCK_0)
FPGA_TDI: R64.1 R65.1 U42.N7(TDI_0)
FPGA_TDO: R63.1 R66.1 U42.N8(TDO_0)
FPGA_TMS: R49.1 R68.1 U42.M7(TMS_0)
FT2232_USB_DM: U6.7(A:DM) X2.2
FT2232_USB_DP: U6.8(A:DP) X2.3
FT_+1V8: C191.2 U6.12(B:VCORE_2) U6.37(B:VCORE) U6.49(A:VREGOUT) U6.64(A:VCORE)
FT_CLKOUT: U6.32(A:ACBUS5) U42.T4(IO_L9P_T1_DQS_34)
FT_D0: U6.16(A:ADBUS0) U42.N1(IO_L4P_T0_34)
FT_D1: U6.17(A:ADBUS1) U42.P1(IO_L4N_T0_34)
FT_D2: U6.18(A:ADBUS2) U42.R1(IO_L7N_T1_34)
FT_D3: U6.19(A:ADBUS3) U42.N2(IO_L3N_T0_DQS_34)
FT_D4: U6.21(A:ADBUS4) U42.R2(IO_L7P_T1_34)
FT_D5: U6.22(A:ADBUS5) U42.T2(IO_L8N_T1_34)
FT_D6: U6.23(A:ADBUS6) U42.N3(IO_L3P_T0_DQS_34)
FT_D7: U6.24(A:ADBUS7) U42.P3(IO_L5N_T0_34)
FT_OE#: U6.33(A:ACBUS6) U42.L5(IO_0_34)
FT_RD#: U6.28(A:ACBUS2) U42.L4(IO_L1P_T0_34)
FT_RESET#: R61.2 U6.14(A:RESET-)
FT_RXF#: U6.26(A:ACBUS0) U42.T3(IO_L9N_T1_DQS_34)
FT_SIWUA: U6.30(A:ACBUS4) U42.P5(IO_L10P_T1_34)
FT_TXE#: U6.27(A:ACBUS1) U42.N4(IO_L6N_T0_VREF_34)
FT_WR#: U6.29(A:ACBUS3) U42.P4(IO_L5P_T0_34)
GND: C17.1 C18.2 C19.2 C20.2 C21.2 C22.2 C23.2 C24.2 C25.2 C26.2 C27.2 C28.2 C29.2 C30.2 C31.2 C32.2 C33.2 C34.2 C35.2 C37.2 C38.2 C40.2 C41.2 C42.2 C43.1 C44.1 C45.1 C46.1 C47.1 C48.1 C49.1 C50.1 C51.1 C52.1 C53.1 C54.2 C55.1 C108.1 C109.1 C110.1 C111.1 C112.1 C113.1 C153.1 C154.1 C155.1 C156.1 C157.1 C158.1 C159.1 C164.1 C176.1 C177.1 C178.1 C179.1 C180.1 C181.1 C182.1 C184.2 C185.2 C186.C(-) C187.C(-) C188.1 C189.2 C190.1 C191.1 C192.1 C193.1 C194.1 C195.1 D2.C D3.C D4.C D5.C IC1.5(GND) JP2.3 JP3.8 JP4.2 JP5.1 L7.2 R16.1 R31.1 R32.1 R33.2 R35.1 R37.1 R60.2 R115.1 R116.1 R117.1 R118.1 R119.1 R139.1 R140.1 S1.1 S1.2 TP18.1 U2.16(C:VSS_2) U2.31(C:VSSA) U2.38(C:VSS_3) U2.51(C:VSS_4) U2.61(C:VSS_5) U2.83(C:VSS_6) U2.94(C:VSS_7) U2.107(C:VSS_8) U2.120(C:VSS_9) U2.130(C:VSS) U2.138(B:BOOT0) U3.26(DCOM) U4.4(GND_2) U4.5(GND_3) U4.8(GND_4) U4.11(GND_5) U4.14(GND_6) U4.23(OGND) U4.30(GND) U4.31(REFIN) U6.1(B:GND_2) U6.5(B:GND_3) U6.10(B:AGND) U6.11(B:GND_4) U6.13(A:TEST) U6.15(B:GND_5) U6.25(B:GND_6) U6.35(B:GND_7) U6.47(B:GND_8) U6.51(B:GND) U6.65(A:EPAD) U9.B3(VSS) U10.21(EPAD) U42.A1(GND) U42.A11(GND) U42.B8(GND) U42.C5(GND) U42.C15(GND) U42.D2(GND) U42.D12(GND) U42.E9(GND) U42.F6(GND) U42.F10(GND) U42.F16(GND) U42.G3(GND) U42.G7(GNDADC_0) U42.G9(GND) U42.G13(GND) U42.H6(GND) U42.H7(VREFN_0) U42.H8(VP_0) U42.J7(VN_0) U42.J9(GND) U42.J11(GND) U42.K4(GND) U42.K6(GND) U42.K7(DXN_0) U42.K8(DXP_0) U42.K14(GND) U42.L1(GND) U42.L11(GND) U42.M8(GND) U42.N5(GND) U42.N15(GND) U42.P2(GND) U42.P12(GND) U42.R9(GND) U42.T6(GND) U42.T16(GND) X2.4 X2.5 XTAL4.2(GND_2) XTAL4.4(GND) ; also sheet 1,3
M3S_VCTRL: U42.P8(IO_L20P_T3_A08_D24_14) ; also sheet 3
MIX_RX_EN: U42.M6(IO_L19P_T3_A10_D26_14) ; also sheet 3
MIX_TX_EN: U42.C11(IO_L11P_T1_SRCC_15) ; also sheet 3
N$4: U10.1(XA) XTAL4.3(HOT)
N$5: U10.2(XB) XTAL4.1(HOT_2)
N$6: R16.2 U10.3(A0)
N$7: C23.1 U2.71(C:VCAP_1)
N$8: C22.1 U2.106(C:VCAP_2)
N$9: C24.1 L5.1 U2.32(C:VREF+) U2.33(C:VDDA)
N$10: R23.2 U3.1(DB7)
N$11: R24.2 U3.2(DB6)
N$12: R25.2 U3.3(DB5)
N$13: R26.2 U3.4(DB4)
N$14: R27.2 U3.5(DB3)
N$16: R28.2 U3.6(DB2)
N$18: R29.2 U3.7(DB1)
N$19: R30.2 U3.8(DB0)
N$22: R33.1 U3.18(FSADJ)
N$25: R51.1 U9.B2(C)
N$32: JP3.1 R49.2
N$33: JP3.3 R62.2
N$34: JP3.5 R63.2
N$36: JP3.7 R64.2
N$37: C38.1 U3.23(COMP2)
N$52: R110.2 U2.79(A:PD10)
N$90: IC1.4(DO) R83.1 R146.2
N$91: R112.2 U2.80(A:PD11)
N$92: D3.A R114.1
N$93: R113.2 U2.81(A:PD12)
N$94: R114.2 U2.82(A:PD13)
N$95: D2.A R113.1
N$96: C39.1 U3.19(COMP1)
N$97: D4.A R112.1
N$98: D5.A R110.1
N$106: R138.2 U42.M9(M0_0)
N$107: R139.2 U42.M10(M1_0)
N$108: R140.2 U42.M11(M2_0)
N$109: R141.2 U42.L9(PROGRAM_B_0)
N$114: R142.2 U42.E7(CFGBVS_0)
N$115: R144.1 U42.H10(DONE_0)
N$116: R143.1 U42.K10(INIT_B_0)
N$117: R60.1 U6.6(A:REF)
N$118: C184.1 U6.2(A:OSCI) Y1.P1
N$119: C185.1 U6.3(A:OSCO) Y1.P3
N$120: C186.A(+) C188.2 L20.1 U6.9(B:VPLL)
N$121: C187.A(+) C189.1 L19.1 U6.4(B:VPHY)
N$122: IC1.1(CS) R145.1 U6.63(A:EECS)
N$123: IC1.2(SK) R84.1 U6.62(A:EECLK)
N$124: IC1.3(DI) R146.1 U6.61(A:EEDATA)
RX_2: TP17.1 U2.37(A:PA3)
SI5351_CLK0: U10.13(CLK0)
SI5351_CLK1: U10.12(CLK1)
SI5351_CLK2: U10.9(CLK2)
SI5351_CLK3: U10.8(CLK3)
SI5351_CLK4: U10.19(CLK4) U42.N11(IO_L13P_T2_MRCC_14)
SI5351_CLK5: U10.17(CLK5)
SI5351_CLK6: U10.16(CLK6) ; also sheet 3
SI5351_CLK7: U10.15(CLK7)
SI5351_CLOCKS_EN: R19.1 U2.134(A:PB4) U10.7(OEB)
SI5351_SS_EN: R20.1 U2.135(A:PB5) U10.6(SSEN)
STM32_MISO: U2.42(A:PA6) U42.G14(IO_L21P_T3_DQS_15) ; also sheet 3
STM32_MISO_1V8: U42.A5(IO_L3P_T0_DQS_AD5P_35) ; also sheet 3
STM32_MOSI: U2.43(A:PA7) U42.H13(IO_L20N_T3_A19_15) ; also sheet 3
STM32_MOSI_1V8: U42.B5(IO_L2N_T0_AD12N_35) ; also sheet 3
STM32_NRST: C164.2 JP2.5 R111.1 S1.3 S1.4 U2.25(B:NRST)
STM32_OSC_32N: C18.1 U2.8(A:PC14) XTAL3.2
STM32_OSC_32P: C19.1 U2.9(A:PC15) XTAL3.1
STM32_OSC_N: C20.1 U2.23(B:PH0) XTAL1.2
STM32_OSC_P: C21.1 U2.24(B:PH1) XTAL1.1
STM32_SCL1: JP5.3 R21.1 U2.136(A:PB6) U10.4(SCL)
STM32_SCLK: U2.41(A:PA5) U42.E12(IO_L13P_T2_MRCC_15) ; also sheet 3
STM32_SCLK_1V8: U42.F5(IO_L13P_T2_MRCC_35) ; also sheet 3
STM32_SDA1: JP5.2 R22.1 U2.137(A:PB7) U10.5(SDA)
STM32_SWCLK: JP2.2 U2.109(A:PA14)
STM32_SWDIO: JP2.4 U2.105(A:PA13)
STM32_SWO: JP2.6 U2.133(A:PB3)
TX_2: TP16.1 U2.36(A:PA2)
Unconnected: IC1.6(NC) IC1.7(DC) JP3.4 JP3.6 U2.1(B:PE2) U2.2(B:PE3) U2.3(B:PE4) U2.4(B:PE5) U2.5(B:PE6) U2.7(A:PC13) U2.10(B:PF0) U2.11(B:PF1) U2.12(B:PF2) U2.13(B:PF3) U2.14(B:PF4) U2.15(B:PF5) U2.18(B:PF6) U2.19(B:PF7) U2.20(B:PF8) U2.21(B:PF9) U2.22(B:PF10) U2.34(A:PA0) U2.35(A:PA1) U2.40(A:PA4) U2.46(A:PB0) U2.47(A:PB1) U2.48(A:PB2) U2.49(B:PF11) U2.50(B:PF12) U2.53(B:PF13) U2.54(B:PF14) U2.55(B:PF15) U2.56(B:PG0) U2.57(B:PG1) U2.58(B:PE7) U2.59(B:PE8) U2.60(B:PE9) U2.63(B:PE10) U2.64(B:PE11) U2.65(B:PE12) U2.66(B:PE13) U2.67(B:PE14) U2.68(B:PE15) U2.69(A:PB10) U2.70(A:PB11) U2.73(A:PB12) U2.74(A:PB13) U2.77(A:PD8) U2.78(A:PD9) U2.85(A:PD14) U2.86(A:PD15) U2.87(B:PG2) U2.88(B:PG3) U2.89(B:PG4) U2.90(B:PG5) U2.91(B:PG6) U2.92(B:PG7) U2.93(B:PG8) U2.98(A:PC8) U2.99(A:PC9) U2.104(A:PA12) U2.110(A:PA15) U2.111(A:PC10) U2.112(A:PC11) U2.113(A:PC12) U2.118(A:PD4) U2.119(A:PD5) U2.122(A:PD6) U2.123(A:PD7) U2.124(B:PG9) U2.125(B:PG10) U2.126(B:PG11) U2.127(B:PG12) U2.128(B:PG13) U2.129(B:PG14) U2.132(B:PG15) U2.139(A:PB8) U2.140(A:PB9) U2.141(B:PE0) U2.142(B:PE1) U3.9(NC_2) U3.10(NC_3) U3.11(NC_4) U3.12(NC_5) U3.13(NC_6) U3.14(NC_7) U3.25(NC) U4.22(TP) U4.29(REFOUT) U6.34(A:ACBUS7) U6.36(A:SUSPEND-) U6.38(A:BDBUS0) U6.39(A:BDBUS1) U6.40(A:BDBUS2) U6.41(A:BDBUS3) U6.43(A:BDBUS4) U6.44(A:BDBUS5) U6.45(A:BDBUS6) U6.46(A:BDBUS7) U6.48(A:BCBUS0) U6.52(A:BCBUS1) U6.53(A:BCBUS2) U6.54(A:BCBUS3) U6.55(A:BCBUS4) U6.57(A:BCBUS5) U6.58(A:BCBUS6) U6.59(A:BCBUS7) U6.60(A:PWREN-) U9.A2(NC) U9.A3(RFU_2) U9.A5(RFU_3) U9.B1(RFU_4) U9.B5(RFU_5) U9.C1(RFU_6) U9.C3(RFU_7) U9.C5(RFU_8) U9.D1(RFU_9) U9.D5(RFU_10) U9.E1(RFU_11) U9.E2(RFU_12) U9.E3(RFU_13) U9.E4(RFU_14) U9.E5(RFU) U42.A2(IO_L8N_T1_AD14N_35) U42.B1(IO_L9N_T1_DQS_AD7N_35) U42.B2(IO_L8P_T1_AD14P_35) U42.B9(IO_L3P_T0_DQS_AD1P_15) U42.B12(IO_L5P_T0_AD9P_15) U42.B14(IO_L8N_T1_AD10N_15) U42.B15(IO_L9P_T1_DQS_AD3P_15) U42.B16(IO_L10N_T1_AD11N_15) U42.C1(IO_L9P_T1_DQS_AD7P_35) U42.C2(IO_L7N_T1_AD6N_35) U42.C3(IO_L7P_T1_AD6P_35) U42.C4(IO_L12N_T1_MRCC_35) U42.C8(IO_L1P_T0_AD0P_15) U42.C9(IO_L1N_T0_AD0N_15) U42.C12(IO_L11N_T1_SRCC_15) U42.C14(IO_L8P_T1_AD10P_15) U42.C16(IO_L10P_T1_AD11P_15) U42.D1(IO_L10N_T1_AD15N_35) U42.D3(IO_L11N_T1_SRCC_35) U42.D4(IO_L12P_T1_MRCC_35) U42.D5(IO_L6N_T0_VREF_35) U42.D8(IO_L6P_T0_15) U42.D9(IO_L6N_T0_VREF_15) U42.D10(IO_0_15) U42.D11(IO_L14N_T2_SRCC_15) U42.D13(IO_L12P_T1_MRCC_15) U42.D14(IO_L15P_T2_DQS_15) U42.D15(IO_L15N_T2_DQS_ADV_B_15) U42.E2(IO_L10P_T1_AD15P_35) U42.E3(IO_L11P_T1_SRCC_35) U42.E5(IO_L13N_T2_MRCC_35) U42.E11(IO_L14P_T2_SRCC_15) U42.E13(IO_L13N_T2_MRCC_15) U42.F3(IO_L14N_T2_SRCC_35) U42.F4(IO_L14P_T2_SRCC_35) U42.F12(IO_L16P_T2_A28_15) U42.G11(IO_25_15) U42.G15(IO_L24N_T3_RS0_15) U42.H1(IO_L20N_T3_35) U42.H2(IO_L20P_T3_35) U42.H3(IO_L21N_T3_DQS_35) U42.H4(IO_L18N_T2_35) U42.H5(IO_L18P_T2_35) U42.H14(IO_L24P_T3_RS1_15) U42.J1(IO_L22N_T3_35) U42.J3(IO_L21P_T3_DQS_35) U42.J4(IO_L19N_T3_VREF_35) U42.J5(IO_L19P_T3_35) U42.J16(IO_L23N_T3_FWE_B_15) U42.K1(IO_L22P_T3_35) U42.K2(IO_L24N_T3_35) U42.K3(IO_L24P_T3_35) U42.K5(IO_25_35) U42.K12(IO_0_14) U42.K13(IO_L5P_T0_D06_14) U42.L2(IO_L23N_T3_35) U42.L3(IO_L23P_T3_35) U42.L14(IO_L4P_T0_D04_14) U42.M1(IO_L2N_T0_34) U42.M2(IO_L2P_T0_34) U42.M4(IO_L1N_T0_34) U42.M5(IO_L6P_T0_34) U42.M12(IO_L6N_T0_D08_VREF_14) U42.M14(IO_L4N_T0_D05_14) U42.M15(IO_L3N_T0_DQS_EMCCLK_14) U42.N6(IO_L19N_T3_A09_D25_VREF_14) U42.N9(IO_L18P_T2_A12_D28_14) U42.N12(IO_L13N_T2_MRCC_14) U42.N13(IO_L11P_T1_SRCC_14) U42.N14(IO_L12P_T1_MRCC_14) U42.P6(IO_25_14) U42.P9(IO_L18N_T2_A11_D27_14) U42.P10(IO_L14P_T2_SRCC_14) U42.P11(IO_L14N_T2_SRCC_14) U42.P13(IO_L11N_T1_SRCC_14) U42.P15(IO_L8P_T1_D11_14) U42.P16(IO_L8N_T1_D12_14) U42.R3(IO_L8P_T1_34) U42.R5(IO_L23P_T3_A03_D19_14) U42.R6(IO_L24P_T3_A01_D17_14) U42.R7(IO_L24N_T3_A00_D16_14) U42.R8(IO_L20N_T3_A07_D23_14) U42.R10(IO_L17P_T2_A14_D30_14) U42.R12(IO_L15P_T2_DQS_RDWR_B_14) U42.R13(IO_L16P_T2_CSI_B_14) U42.T5(IO_L23N_T3_A02_D18_14) U42.T7(IO_L21P_T3_DQS_14) X2.1

### Notes on the sheet
- DIGITAL (FPGA + MICROCONTROLLER) + ADC & DAC